# Altium project koosh.PrjPcb
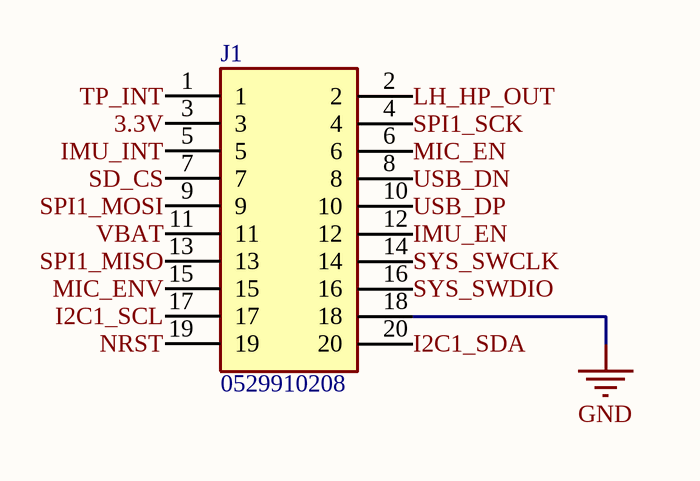
[diagram p0: koosh_connector.SchDoc]
4 sheets, 34 parts. Net scope: global (net labels, ports and power ports of the same name join across sheets).
Board file: koosh_main_board_v1_2.PcbDoc
Sheets:
  koosh_connector.SchDoc
  koosh_mcu.SchDoc
  koosh_sensors.SchDoc
  koosh_power.SchDoc

## Sheet koosh_connector.SchDoc
size A

### Parts
J1  0529910208  [0529910208]

### Nets
GND: J1.18
3.3V: J1.3
I2C1_SCL: J1.17
I2C1_SDA: J1.20
IMU_EN: J1.12
IMU_INT: J1.5
LH_HP_OUT: J1.2
MIC_EN: J1.6
MIC_ENV: J1.15
NRST: J1.19
SD_CS: J1.7
SPI1_MISO: J1.13
SPI1_MOSI: J1.9
SPI1_SCK: J1.4
SYS_SWCLK: J1.14
SYS_SWDIO: J1.16
TP_INT: J1.1
USB_DN: J1.8
USB_DP: J1.10
VBAT: J1.11

### Library data of the parts
J1 = 0529910208: Connector; Manufacturer_Name: Molex; Datasheet Link: https://www.molex.com/pdm_docs/sd/529910208_sd.pdf; Height: 2.47mm; Manufacturer_Part_Number: 0529910208

## Sheet koosh_mcu.SchDoc
size A
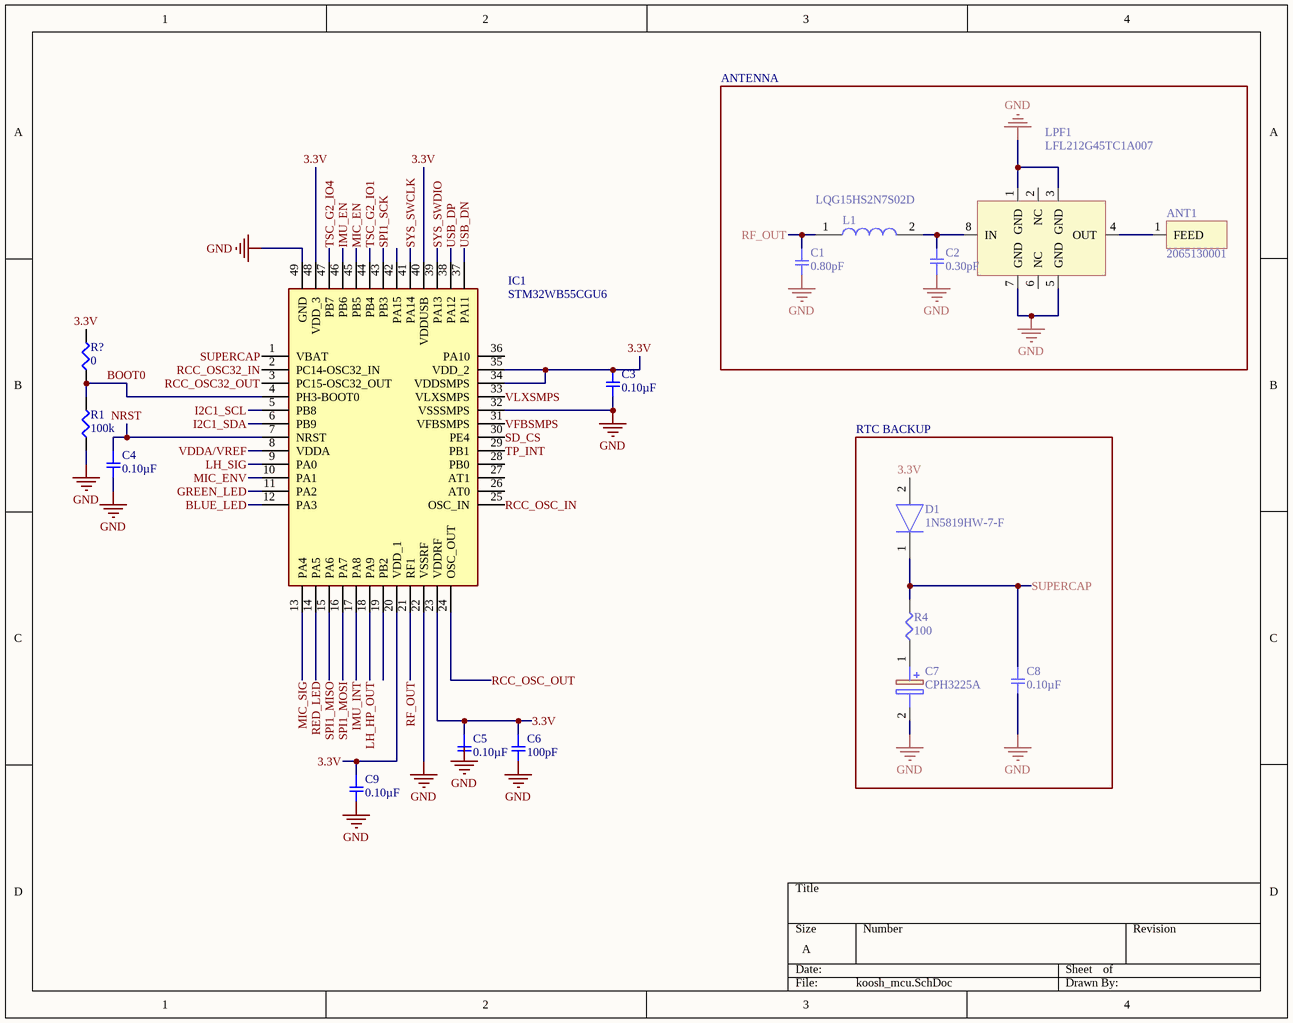
[diagram p1: koosh_mcu.SchDoc]

### Parts
ANT1  2065130001  [2065130001]
C1  0.80pF  [SMD-0402C]
C2  0.30pF  [SMD-0402C]
C3  0.10µF  [SMD-0402C]
C4  0.10µF  [SMD-0402C]
C5  0.10µF  [SMD-0402C]
C6  100pF  [SMD-0402C]
C7  CPH3225A  [CPH3225A]
C8  0.10µF  [SMD-0402C]
C9  0.10µF  [SMD-0402C]
D1  1N5819HW-7-F  [SOD3716X145N]
IC1  STM32WB55CGU6  [QFN50P700X700X65-49N-D]
L1  LQG15HS2N7S02D  [INDC1005X55N]
LPF1  LFL212G45TC1A007  [LFL212G45TC1A007]
R1  100k  [SMD-0402-RES]
R4  100  [SMD-0402-RES]
R?  0  [SMD-0402-RES]

### Blocks framed on the sheet
ANTENNA: ANT1 C1 C2 L1 LPF1
RTC BACKUP: C7 C8 D1 R4

### Nets
GND: C1.2 C2.1 C3.2 C4.2 C6.2 C7.2(-) C8.2 C9.2 IC1.22(VSSRF) IC1.32(VSSSMPS) IC1.49(GND) LPF1.1(GND) LPF1.3(GND) LPF1.5(GND) LPF1.7(GND) R1.1
3.3V: C3.1 C5.1 C6.1 C9.1 D1.2(A) IC1.20(VDD_1) IC1.23(VDDRF) IC1.34(VDDSMPS) IC1.35(VDD_2) IC1.40(VDDUSB) IC1.48(VDD_3) R?.2
BLUE_LED: IC1.12(PA3)
BOOT0: IC1.4(PH3-BOOT0) R1.2 R?.1
GREEN_LED: IC1.11(PA2)
I2C1_SCL: IC1.5(PB8)
I2C1_SDA: IC1.6(PB9)
IMU_EN: IC1.46(PB6)
IMU_INT: IC1.17(PA8)
LH_HP_OUT: IC1.18(PA9)
LH_SIG: IC1.9(PA0)
MIC_EN: IC1.45(PB5)
MIC_ENV: IC1.10(PA1)
MIC_SIG: IC1.13(PA4)
NRST: C4.1 IC1.7(NRST)
RCC_OSC32_IN: IC1.2(PC14-OSC32_IN)
RCC_OSC32_OUT: IC1.3(PC15-OSC32_OUT)
RCC_OSC_IN: IC1.25(OSC_IN)
RCC_OSC_OUT: IC1.24(OSC_OUT)
RED_LED: IC1.14(PA5)
RF_OUT: C1.1 IC1.21(RF1) L1.1
SD_CS: IC1.30(PE4)
SPI1_MISO: IC1.15(PA6)
SPI1_MOSI: IC1.16(PA7)
SPI1_SCK: IC1.43(PB3)
SUPERCAP: C8.1 D1.1(K) IC1.1(VBAT) R4.2
SYS_SWCLK: IC1.41(PA14)
SYS_SWDIO: IC1.39(PA13)
TP_INT: IC1.29(PB1)
TSC_G2_IO1: IC1.44(PB4)
TSC_G2_IO4: IC1.47(PB7)
USB_DN: IC1.37(PA11)
USB_DP: IC1.38(PA12)
VDDA/VREF: IC1.8(VDDA)
VFBSMPS: IC1.31(VFBSMPS)
VLXSMPS: IC1.33(VLXSMPS)
NetANT1_1: ANT1.1(FEED) LPF1.4(OUT)
NetC2_2: C2.2 L1.2 LPF1.8(IN)
NetC7_1: C7.1(+) R4.1

Not connected (* = marked no-connect by the designer): C5 2; IC1 19(PB2) 26(AT0) 27(AT1) 28(PB0) 36(PA10) 42(PA15); LPF1 2(NC) 6(NC)

### Notes on the sheet
- Labels drawn without touching a wire or pin: GND

### Library data of the parts
C1 = GRM1555C1HR80BA01D: CAP CER 0.8PF 50V NP0 0402; Manufacturer: Murata Electronics North America; Factory Stock: 0; Unit Price (USD): 0.1; Minimum Quantity: 1; Tolerance: ±0.1pF; Temperature Coefficient: C0G, NP0; Datasheets: http://www.murata.com/~/media/webrenewal/support/library/catalog/products/capacitor/mlcc/c02e.pdf; Image: //media.digikey.com/Renders/Murata%20Renders/ZRB-SERIES-0402.jpg; Digi-Key Part Number: 490-6269-1-ND; Part Number: GRM1555C1HR80BA01D; Quantity Available: 38847; @ qty: 0; Packaging: Cut Tape (CT); Series: GRM; Part Status: Active; Value: 0.80pF; Voltage: 50V; Operating Temperature: -55°C ~ 125°C; Features: -; Ratings: -; Applications: General Purpose; Mounting Type: Surface Mount, MLCC; Package / Case: 0402 (1005 Metric); Size / Dimension: 0.039" L x 0.020" W (1.00mm x 0.50mm); Height - Seated (Max): -; Thickness (Max): 0.022" (0.55mm); Lead Spacing: -; Lead Style: -
C2 = GRM1555C1HR30WA01D: CAP CER 0.3PF 50V NP0 0402; Manufacturer: Murata Electronics North America; Factory Stock: 0; Unit Price (USD): 0.16; Minimum Quantity: 1; Tolerance: ±0.05pF; Temperature Coefficient: C0G, NP0; Datasheets: http://www.murata.com/~/media/webrenewal/support/library/catalog/products/capacitor/mlcc/c02e.pdf; Image: //media.digikey.com/Renders/Murata%20Renders/ZRB-SERIES-0402.jpg; Digi-Key Part Number: 490-6261-1-ND; Part Number: GRM1555C1HR30WA01D; Quantity Available: 61475; @ qty: 0; Packaging: Cut Tape (CT); Series: GRM; Part Status: Active; Value: 0.30pF; Voltage: 50V; Operating Temperature: -55°C ~ 125°C; Features: -; Ratings: -; Applications: General Purpose; Mounting Type: Surface Mount, MLCC; Package / Case: 0402 (1005 Metric); Size / Dimension: 0.039" L x 0.020" W (1.00mm x 0.50mm); Height - Seated (Max): -; Thickness (Max): 0.022" (0.55mm); Lead Spacing: -; Lead Style: -
C3-C5 C8 C9 = GCM155R71C104KA55D: CAP CER 0.1UF 16V X7R 0402; Manufacturer: Murata Electronics North America; Factory Stock: 0; Unit Price (USD): 0.1; Minimum Quantity: 1; Tolerance: ±10%; Datasheets: http://www.murata.com/~/media/webrenewal/support/library/catalog/products/capacitor/mlcc/c03e.ashx; Image: //media.digikey.com/Renders/Murata%20Renders/ZRB-SERIES-0402.jpg; Digi-Key Part Number: 490-4759-1-ND; Part Number: GCM155R71C104KA55D; Quantity Available: 734194; @ qty: 0; Packaging: Cut Tape (CT); Series: GCM; Part Status: Active; Value: 0.10µF; Voltage: 16V; Temperature Coefficient: X7R; Operating Temperature: -55°C ~ 125°C; Features: -; Ratings: AEC-Q200; Applications: Automotive; Mounting Type: Surface Mount, MLCC; Package / Case: 0402 (1005 Metric); Size / Dimension: 0.039" L x 0.020" W (1.00mm x 0.50mm); Height - Seated (Max): -; Thickness (Max): 0.022" (0.55mm); Lead Spacing: -; Lead Style: -
C6 = GCM1555C1H101JA16D: CAP CER 100PF 50V NP0 0402; Manufacturer: Murata Electronics North America; Factory Stock: 0; Unit Price (USD): 0.1; Minimum Quantity: 1; Tolerance: ±5%; Temperature Coefficient: C0G, NP0; Datasheets: http://www.murata.com/~/media/webrenewal/support/library/catalog/products/capacitor/mlcc/c03e.ashx; Image: //media.digikey.com/Renders/Murata%20Renders/ZRB-SERIES-0402.jpg; Digi-Key Part Number: 490-10669-1-ND; Part Number: GCM1555C1H101JA16D; Quantity Available: 61397; @ qty: 0; Packaging: Cut Tape (CT); Series: GCM; Part Status: Active; Value: 100pF; Voltage: 50V; Operating Temperature: -55°C ~ 125°C; Features: -; Ratings: AEC-Q200; Applications: Automotive; Mounting Type: Surface Mount, MLCC; Package / Case: 0402 (1005 Metric); Size / Dimension: 0.039" L x 0.020" W (1.00mm x 0.50mm); Height - Seated (Max): -; Thickness (Max): 0.022" (0.55mm); Lead Spacing: -; Lead Style: -
C7 = CPH3225A: Capacitor Polarised; Manufacturer_Name: Seiko Instruments Micro Energy; Datasheet Link: https://www.sii.co.jp/en/me/datasheets/chip-capacitor/cph3225a/; Height: 1mm; Manufacturer_Part_Number: CPH3225A; Mouser Part Number: 628-CPH3225A; Mouser Price/Stock: https://www.mouser.com/Search/Refine.aspx?Keyword=628-CPH3225A
D1 = 1N5819HW-7-F: Diode; Manufacturer_Name: Diodes Inc.; Allied_Number: 70437201; Datasheet Link: http://www.diodes.com/_files/datasheets/ds30217.pdf; Height: 1.45mm; Manufacturer_Part_Number: 1N5819HW-7-F; Mouser Part Number: 621-1N5819HW-F; Mouser Price/Stock: https://www.mouser.com/Search/Refine.aspx?Keyword=621-1N5819HW-F; RS Part Number: 7082197P; RS Price/Stock: http://uk.rs-online.com/web/p/products/7082197P; Allied Price/Stock: http://www.alliedelec.com/diodes-inc-1n5819hw-7-f/70437201/
IC1 = STM32WB55CGU6: Integrated Circuit; Manufacturer_Name: STMicroelectronics; Datasheet Link: https://www.st.com/en/microcontrollers/stm32wb55cg.html; Height: 0.65mm; Manufacturer_Part_Number: STM32WB55CGU6; Mouser Part Number: 511-STM32WB55CGU6; Mouser Price/Stock: https://www.mouser.com/Search/Refine.aspx?Keyword=511-STM32WB55CGU6
L1 = LQG15HS2N7S02D: Inductor; Manufacturer_Name: Murata Electronics; Datasheet Link: https://www.arrow.com/en/products/lqg15hs2n7s02d/murata-manufacturing; Height: 0.55mm; Manufacturer_Part_Number: LQG15HS2N7S02D
R1 = ERJ-2RKF1003X: RES SMD 100K OHM 1% 1/10W 0402; Manufacturer: Panasonic Electronic Components; Factory Stock: 0; Unit Price (USD): 0.00496; @ qty: 1500; Minimum Quantity: 1; Power (Watts): 0.1W, 1/10W; Temperature Coefficient: ±100ppm/°C; Part Number: ERJ-2RKF1003X; Datasheets: http://industrial.panasonic.com/www-cgi/jvcr13pz.cgi?E+PZ+3+AOA0002+ERJ2RKF1003X+7+WW; Image: //media.digikey.com/Photos/Panasonic%20Photos/ERJ-PA2-Series.jpg; Digi-Key Part Number: P100KLCT-ND; Quantity Available: 2645965; Packaging: Cut Tape (CT); Series: ERJ; Part Status: Active; Value: 100k; Tolerance: ±1%; Composition: Thick Film; Features: Automotive AEC-Q200; Operating Temperature: -55°C ~ 155°C; Package / Case: 0402 (1005 Metric); Supplier Device Package: 0402; Size / Dimension: 0.039" L x 0.020" W (1.00mm x 0.50mm); Height - Seated (Max): 0.016" (0.40mm); Number of Terminations: 2; Failure Rate: -
R4 = ERJ-2RKF1003X: RES SMD 100 OHM 5% 1/4W 0603; Manufacturer: Panasonic Electronic Components; Factory Stock: 0; Unit Price (USD): 0.00496; @ qty: 1500; Minimum Quantity: 1; Tolerance: ±1%; Power (Watts): 0.1W, 1/10W; Temperature Coefficient: ±100ppm/°C; Part Number: ERJ-2RKF1003X; Datasheets: http://industrial.panasonic.com/www-cgi/jvcr13pz.cgi?E+PZ+3+AOA0002+ERJ2RKF1003X+7+WW; Image: //media.digikey.com/Photos/Panasonic%20Photos/ERJ-PA2-Series.jpg; Digi-Key Part Number: P100KLCT-ND; Quantity Available: 2645965; Packaging: Cut Tape (CT); Series: ERJ; Part Status: Active; Value: 100; Composition: Thick Film; Features: Automotive AEC-Q200; Operating Temperature: -55°C ~ 155°C; Package / Case: 0603 (1608 Metric); Supplier Device Package: 0603; Size / Dimension: 0.039" L x 0.020" W (1.00mm x 0.50mm); Height - Seated (Max): 0.016" (0.40mm); Number of Terminations: 2; Failure Rate: -
R? = ERJ-2RKF1003X: RES SMD 0 OHM 1% 1/10W 0402; Manufacturer: Panasonic Electronic Components; Unit Price (USD): 0.00496; @ qty: 1500; Minimum Quantity: 1; Power (Watts): 0.1W, 1/10W; Temperature Coefficient: ±100ppm/°C; Part Number: ERJ-2RKF1003X; Datasheets: http://industrial.panasonic.com/www-cgi/jvcr13pz.cgi?E+PZ+3+AOA0002+ERJ2RKF1003X+7+WW; Image: //media.digikey.com/Photos/Panasonic%20Photos/ERJ-PA2-Series.jpg; Digi-Key Part Number: P100KLCT-ND; Quantity Available: 2645965; Factory Stock: 0; Packaging: Cut Tape (CT); Series: ERJ; Part Status: Active; Value: 0; Tolerance: ±1%; Composition: Thick Film; Features: Automotive AEC-Q200; Operating Temperature: -55°C ~ 155°C; Package / Case: 0402 (1005 Metric); Supplier Device Package: 0402; Size / Dimension: 0.039" L x 0.020" W (1.00mm x 0.50mm); Height - Seated (Max): 0.016" (0.40mm); Number of Terminations: 2; Failure Rate: -

## Sheet koosh_sensors.SchDoc
size A
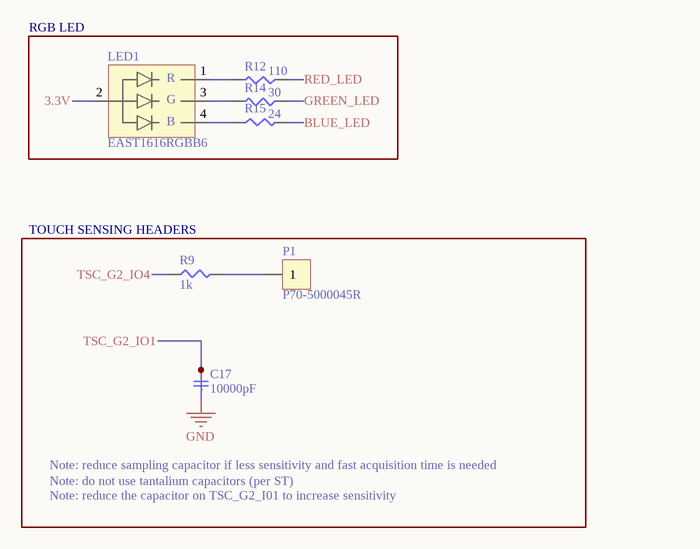
[diagram p2: koosh_sensors.SchDoc]

### Parts
C17  10000pF  [SMD-0402C]
LED1  EAST1616RGBB6  [EAST1616RGBB6]
P1  P70-5000045R  [P70-5000045R]
R9  1k  [SMD-0402-RES]
R12  110  [SMD-0402-RES]
R14  30  [SMD-0402-RES]
R15  24  [SMD-0402-RES]

### Blocks framed on the sheet
RGB LED: LED1 R12 R14 R15

### Nets
GND: C17.1
3.3V: LED1.2
BLUE_LED: R15.2
GREEN_LED: R14.1
RED_LED: R12.1
TSC_G2_IO1: C17.2
TSC_G2_IO4: R9.1
NetLED1_1: LED1.1 R12.2
NetLED1_3: LED1.3 R14.2
NetLED1_4: LED1.4 R15.1
NetP1_1: P1.1 R9.2

### Notes on the sheet
- (near R9) TOUCH SENSING HEADERS
- Note: reduce sampling capacitor if less sensitivity and fast acquisition time is needed
- Note: do not use tantalium capacitors (per ST)
- Note: reduce the capacitor on TSC_G2_I01 to increase sensitivity
- (in symbol EAST1616RGBB6) R; G; B

### Library data of the parts
C17 = GCM155R71H103KA55D: CAP CER 10000PF 50V X7R 0402; Manufacturer: Murata Electronics North America; Factory Stock: 0; Unit Price (USD): 0.1; Minimum Quantity: 1; Tolerance: ±10%; Datasheets: http://www.murata.com/~/media/webrenewal/support/library/catalog/products/capacitor/mlcc/c03e.ashx; Image: //media.digikey.com/Renders/Murata%20Renders/ZRB-SERIES-0402.jpg; Digi-Key Part Number: 490-4762-1-ND; Part Number: GCM155R71H103KA55D; Quantity Available: 650067; @ qty: 0; Packaging: Cut Tape (CT); Series: GCM; Part Status: Active; Value: 10000pF; Voltage: 50V; Temperature Coefficient: X7R; Operating Temperature: -55°C ~ 125°C; Features: -; Ratings: AEC-Q200; Applications: Automotive; Mounting Type: Surface Mount, MLCC; Package / Case: 0402 (1005 Metric); Size / Dimension: 0.039" L x 0.020" W (1.00mm x 0.50mm); Height - Seated (Max): -; Thickness (Max): 0.022" (0.55mm); Lead Spacing: -; Lead Style: -
R9 = ERJ-2GEJ102X: RES SMD 1K OHM 5% 1/10W 0402; Manufacturer: Panasonic Electronic Components; Factory Stock: 0; Unit Price (USD): 0.00350; @ qty: 1500; Minimum Quantity: 1; Power (Watts): 0.1W, 1/10W; Temperature Coefficient: ±200ppm/°C; Part Number: ERJ-2GEJ102X; Datasheets: http://industrial.panasonic.com/www-cgi/jvcr13pz.cgi?E+PZ+3+AOA0001+ERJ2GEJ102X+7+WW; Image: //media.digikey.com/Photos/Panasonic%20Photos/ERJ-PA2-Series.jpg; Digi-Key Part Number: P1.0KJCT-ND; Quantity Available: 1939857; Packaging: Cut Tape (CT); Series: ERJ; Part Status: Active; Value: 1k; Tolerance: ±5%; Composition: Thick Film; Features: Automotive AEC-Q200; Operating Temperature: -55°C ~ 155°C; Package / Case: 0402 (1005 Metric); Supplier Device Package: 0402; Size / Dimension: 0.039" L x 0.020" W (1.00mm x 0.50mm); Height - Seated (Max): 0.016" (0.40mm); Number of Terminations: 2; Failure Rate: -
R12 R14 R15 = ERJ-2GEJ103X: RES SMD 110 OHM 5% 1/10W 0402; Manufacturer: Panasonic Electronic Components; Factory Stock: 0; Unit Price (USD): 0.00350; @ qty: 1500; Minimum Quantity: 1; Power (Watts): 0.1W, 1/10W; Temperature Coefficient: ±200ppm/°C; Part Number: ERJ-2GEJ103X; Datasheets: http://industrial.panasonic.com/www-cgi/jvcr13pz.cgi?E+PZ+3+AOA0001+ERJ2GEJ103X+7+WW; Image: //media.digikey.com/Photos/Panasonic%20Photos/ERJ-PA2-Series.jpg; Digi-Key Part Number: P10KJCT-ND; Quantity Available: 2560215; Packaging: Cut Tape (CT); Series: ERJ; Part Status: Active; Tolerance: ±5%; Composition: Thick Film; Features: Automotive AEC-Q200; Operating Temperature: -55°C ~ 155°C; Package / Case: 0402 (1005 Metric); Supplier Device Package: 0402; Size / Dimension: 0.039" L x 0.020" W (1.00mm x 0.50mm); Height - Seated (Max): 0.016" (0.40mm); Number of Terminations: 2; Failure Rate: -
  R12: Value: 110
  R14: Value: 30
  R15: Value: 24

## Sheet koosh_power.SchDoc
size A
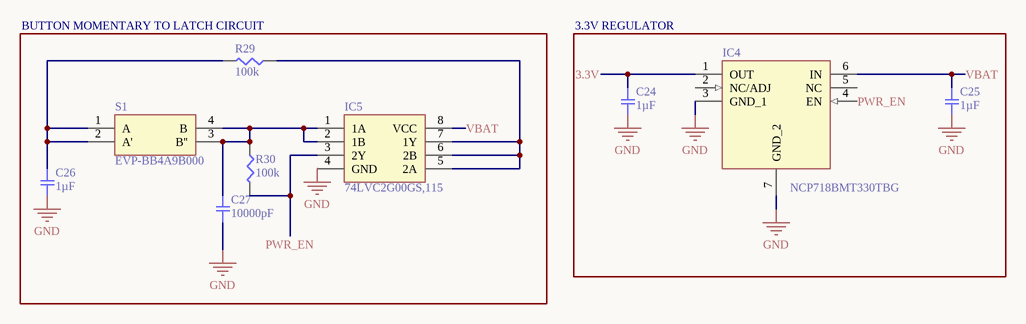
[diagram p3: koosh_power.SchDoc]

### Parts
C24  1µF  [SMD-0402C]
C25  1µF  [SMD-0402C]
C26  1µF  [SMD-0402C]
C27  10000pF  [SMD-0402C]
IC4  NCP718BMT330TBG  [SON65P200X200X80-7N]
IC5  74LVC2G00GS,115  [74AXP2T3407GSX]
R29  100k  [SMD-0402-RES]
R30  100k  [SMD-0402-RES]
S1  EVP-BB4A9B000  [EVPBB2A9B000]

### Blocks framed on the sheet
BUTTON MOMENTARY TO LATCH CIRCUIT: C26 C27 IC5 R29 R30 S1
3.3V REGULATOR: C24 C25 IC4

### Nets
GND: C24.2 C25.2 C26.2 C27.1 IC4.3(GND_1) IC4.7(GND_2) IC5.4(GND)
3.3V: C24.1 IC4.1(OUT)
PWR_EN: IC4.4(EN) IC5.3(2Y) R30.2
VBAT: C25.1 IC4.6(IN) IC5.8(VCC)
NetC26_1: C26.1 R29.2 S1.1(A) S1.2(A')
NetC27_2: C27.2 IC5.1(1A) IC5.2(1B) R30.1 S1.3(B'') S1.4(B)
NetIC5_5: IC5.5(2A) IC5.6(2B) IC5.7(1Y) R29.1

Not connected (* = marked no-connect by the designer): IC4 2(NC/ADJ) 5(NC)

### Library data of the parts
C24-C26 = GCM155C71A105KE38D: CAP CER 1UF 10V X7S 0402; Manufacturer: Murata Electronics North America; Factory Stock: 0; Unit Price (USD): 0.12; Minimum Quantity: 1; Tolerance: ±10%; Datasheets: http://www.murata.com/~/media/webrenewal/support/library/catalog/products/capacitor/mlcc/c03e.ashx; Image: //media.digikey.com/Renders/Murata%20Renders/ZRB-SERIES-0402.jpg; Digi-Key Part Number: 490-13409-1-ND; Part Number: GCM155C71A105KE38D; Quantity Available: 7240; @ qty: 0; Packaging: Cut Tape (CT); Series: GCM; Part Status: Active; Value: 1µF; Voltage: 10V; Temperature Coefficient: X7S; Operating Temperature: -55°C ~ 125°C; Features: -; Ratings: AEC-Q200; Applications: Automotive; Mounting Type: Surface Mount, MLCC; Package / Case: 0402 (1005 Metric); Size / Dimension: 0.039" L x 0.020" W (1.00mm x 0.50mm); Height - Seated (Max): -; Thickness (Max): 0.022" (0.55mm); Lead Spacing: -; Lead Style: -
C27 = GCM155R71H103KA55D: as C17 on sheet koosh_sensors; Datasheets: http://www.murata.com/~/media/webrenewal/support/library/catalog/products/capacitor/mlcc/c03e.ashx; Image: //media.digikey.com/Renders/Murata%20Renders/ZRB-SERIES-0402.jpg; Digi-Key Part Number: 490-4762-1-ND; Part Number: GCM155R71H103KA55D; Quantity Available: 650067; @ qty: 0; Packaging: Cut Tape (CT); Series: GCM; Part Status: Active; Value: 10000pF; Voltage: 50V; Temperature Coefficient: X7R; Operating Temperature: -55°C ~ 125°C; Features: -; Ratings: AEC-Q200; Applications: Automotive; Mounting Type: Surface Mount, MLCC; Package / Case: 0402 (1005 Metric); Size / Dimension: 0.039" L x 0.020" W (1.00mm x 0.50mm); Height - Seated (Max): -; Thickness (Max): 0.022" (0.55mm); Lead Spacing: -; Lead Style: -
IC4 = NCP718BMT330TBG: Integrated Circuit; Manufacturer_Name: ON Semiconductor; Datasheet Link: https://componentsearchengine.com/Datasheets/1/NCP718BMT330TBG.pdf; Height: 0.8mm; Manufacturer_Part_Number: NCP718BMT330TBG; Mouser Part Number: 863-NCP718BMT330TBG; Mouser Price/Stock: https://www.mouser.com/Search/Refine.aspx?Keyword=863-NCP718BMT330TBG; RS Part Number: 1861278; RS Price/Stock: http://uk.rs-online.com/web/p/products/1861278
IC5 = 74LVC2G00GS,115: Integrated Circuit; Manufacturer_Name: Nexperia; Datasheet Link: https://assets.nexperia.com/documents/data-sheet/74LVC2G00.pdf; Height: 0.35mm; Manufacturer_Part_Number: 74LVC2G00GS,115
R29 R30 = ERJ-2GEJ104X: RES SMD 100K OHM 5% 1/10W 0402; Manufacturer: Panasonic Electronic Components; Factory Stock: 0; Unit Price (USD): 0.00350; @ qty: 1500; Minimum Quantity: 1; Power (Watts): 0.1W, 1/10W; Temperature Coefficient: ±200ppm/°C; Part Number: ERJ-2GEJ104X; Datasheets: http://industrial.panasonic.com/www-cgi/jvcr13pz.cgi?E+PZ+3+AOA0001+ERJ2GEJ104X+7+WW; Image: //media.digikey.com/Photos/Panasonic%20Photos/ERJ-PA2-Series.jpg; Digi-Key Part Number: P100KJCT-ND; Quantity Available: 2387986; Packaging: Cut Tape (CT); Series: ERJ; Part Status: Active; Value: 100k; Tolerance: ±5%; Composition: Thick Film; Features: Automotive AEC-Q200; Operating Temperature: -55°C ~ 155°C; Package / Case: 0402 (1005 Metric); Supplier Device Package: 0402; Size / Dimension: 0.039" L x 0.020" W (1.00mm x 0.50mm); Height - Seated (Max): 0.016" (0.40mm); Number of Terminations: 2; Failure Rate: -
S1 = EVP-BB4A9B000: Switch; Manufacturer_Name: Panasonic; Datasheet Link: https://industrial.panasonic.com/ac/cdn/e/control/switch/light-touch/catalog/sw_lt_eng_2616s.pdf; Height: 0mm; Manufacturer_Part_Number: EVP-BB4A9B000; Mouser Part Number: 667-EVP-BB4A9B000; Mouser Price/Stock: https://www.mouser.com/Search/Refine.aspx?Keyword=667-EVP-BB4A9B000

## Nets that join several sheets
GND: koosh_connector (J1.18), koosh_mcu (16 pins), koosh_sensors (C17.1), koosh_power (7 pins)
3.3V: koosh_connector (J1.3), koosh_mcu (12 pins), koosh_sensors (LED1.2), koosh_power (C24.1 IC4.1)
BLUE_LED: koosh_mcu (IC1.12), koosh_sensors (R15.2)
GREEN_LED: koosh_mcu (IC1.11), koosh_sensors (R14.1)
I2C1_SCL: koosh_connector (J1.17), koosh_mcu (IC1.5)
I2C1_SDA: koosh_connector (J1.20), koosh_mcu (IC1.6)
IMU_EN: koosh_connector (J1.12), koosh_mcu (IC1.46)
IMU_INT: koosh_connector (J1.5), koosh_mcu (IC1.17)
LH_HP_OUT: koosh_connector (J1.2), koosh_mcu (IC1.18)
MIC_EN: koosh_connector (J1.6), koosh_mcu (IC1.45)
MIC_ENV: koosh_connector (J1.15), koosh_mcu (IC1.10)
NRST: koosh_connector (J1.19), koosh_mcu (C4.1 IC1.7)
RED_LED: koosh_mcu (IC1.14), koosh_sensors (R12.1)
SD_CS: koosh_connector (J1.7), koosh_mcu (IC1.30)
SPI1_MISO: koosh_connector (J1.13), koosh_mcu (IC1.15)
SPI1_MOSI: koosh_connector (J1.9), koosh_mcu (IC1.16)
SPI1_SCK: koosh_connector (J1.4), koosh_mcu (IC1.43)
SYS_SWCLK: koosh_connector (J1.14), koosh_mcu (IC1.41)
SYS_SWDIO: koosh_connector (J1.16), koosh_mcu (IC1.39)
TP_INT: koosh_connector (J1.1), koosh_mcu (IC1.29)
TSC_G2_IO1: koosh_mcu (IC1.44), koosh_sensors (C17.2)
TSC_G2_IO4: koosh_mcu (IC1.47), koosh_sensors (R9.1)
USB_DN: koosh_connector (J1.8), koosh_mcu (IC1.37)
USB_DP: koosh_connector (J1.10), koosh_mcu (IC1.38)
VBAT: koosh_connector (J1.11), koosh_power (C25.1 IC4.6 IC5.8)